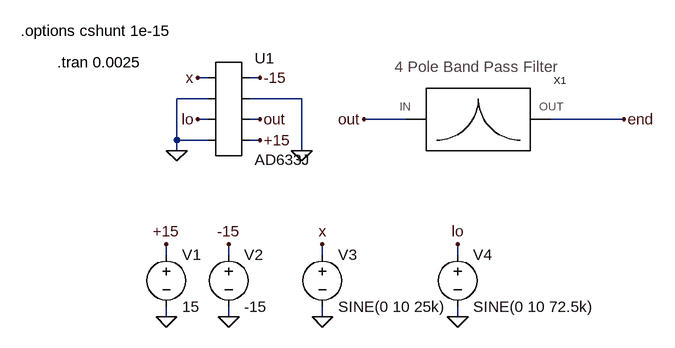
[diagram p0: schematic Draft1.asc]
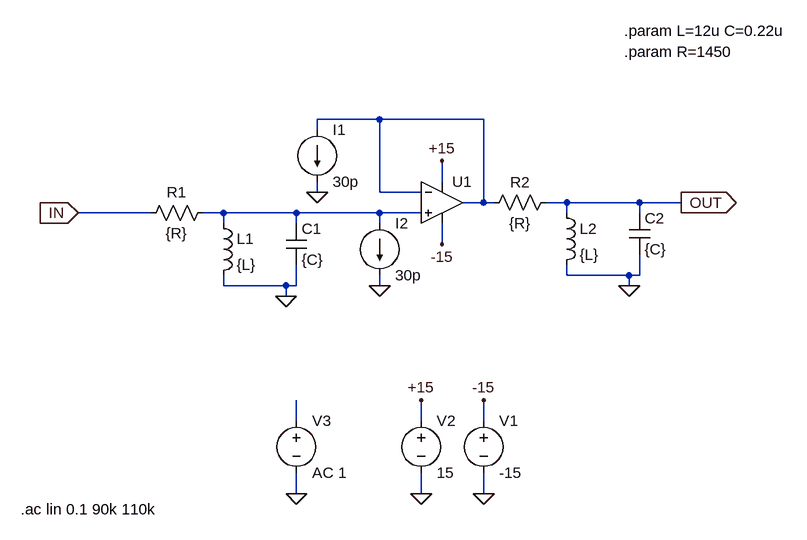
[diagram p1: sub-circuit 4p_bp_filter.asc]
Draft1.asc, the LTspice schematic file:
Version 4
SHEET 1 880 680
WIRE 128 112 112 112
WIRE 208 112 192 112
WIRE 128 144 80 144
WIRE 272 144 192 144
WIRE 128 176 112 176
WIRE 208 176 192 176
WIRE 432 176 368 176
WIRE 768 176 656 176
WIRE 80 208 80 144
WIRE 128 208 80 208
WIRE 208 208 192 208
WIRE 80 224 80 208
WIRE 272 224 272 144
WIRE 64 384 64 368
WIRE 160 384 160 368
WIRE 304 384 304 368
WIRE 512 384 512 368
WIRE 64 480 64 464
WIRE 160 480 160 464
WIRE 304 480 304 464
WIRE 512 480 512 464
FLAG 64 480 0
FLAG 160 480 0
FLAG 304 480 0
FLAG 512 480 0
FLAG 80 224 0
FLAG 64 368 +15
FLAG 160 368 -15
FLAG 304 368 x
FLAG 512 368 lo
FLAG 112 112 x
FLAG 112 176 lo
FLAG 208 208 +15
FLAG 208 112 -15
FLAG 272 224 0
FLAG 208 176 out
FLAG 368 176 out
FLAG 768 176 end
SYMBOL AutoGenerated\\AD633J 160 160 R0
SYMATTR InstName U1
SYMBOL voltage 64 368 R0
WINDOW 123 0 0 Left 0
WINDOW 39 0 0 Left 0
SYMATTR InstName V1
SYMATTR Value 15
SYMBOL voltage 160 368 R0
WINDOW 123 0 0 Left 0
WINDOW 39 0 0 Left 0
SYMATTR InstName V2
SYMATTR Value -15
SYMBOL voltage 304 368 R0
WINDOW 123 0 0 Left 0
WINDOW 39 0 0 Left 0
SYMATTR InstName V3
SYMATTR Value SINE(0 10 25k)
SYMBOL voltage 512 368 R0
WINDOW 123 0 0 Left 0
WINDOW 39 0 0 Left 0
SYMATTR InstName V4
SYMATTR Value SINE(0 10 72.5k)
SYMBOL 4P_BP_Filter 496 192 R0
SYMATTR InstName X1
TEXT -104 88 Left 2 !.tran 0.0025
TEXT -160 40 Left 2 !.options cshunt 1e-15

4p_bp_filter.asc, the sub-circuit schematic file:
Version 4
SHEET 1 880 680
WIRE 48 -80 -48 -80
WIRE 208 -80 48 -80
WIRE -48 -64 -48 -80
WIRE 144 16 144 -16
WIRE -48 32 -48 16
WIRE 48 32 48 -80
WIRE 112 32 48 32
WIRE 208 48 208 -80
WIRE 208 48 176 48
WIRE 224 48 208 48
WIRE 336 48 304 48
WIRE 448 48 336 48
WIRE 512 48 448 48
WIRE -304 64 -416 64
WIRE -192 64 -224 64
WIRE -80 64 -192 64
WIRE 48 64 -80 64
WIRE 112 64 48 64
WIRE 336 64 336 48
WIRE 448 64 448 48
WIRE -192 80 -192 64
WIRE -80 80 -80 64
WIRE 48 80 48 64
WIRE 144 112 144 80
WIRE 336 160 336 144
WIRE 432 160 336 160
WIRE 448 160 448 128
WIRE 448 160 432 160
WIRE -192 176 -192 160
WIRE -96 176 -192 176
WIRE -80 176 -80 144
WIRE -80 176 -96 176
WIRE 48 176 48 160
WIRE 432 176 432 160
WIRE -96 192 -96 176
WIRE -80 384 -80 352
WIRE 112 384 112 352
WIRE 208 384 208 352
WIRE -80 496 -80 464
WIRE 112 496 112 464
WIRE 208 496 208 464
FLAG 112 496 0
FLAG 208 496 0
FLAG 112 352 +15
FLAG 208 352 -15
FLAG 144 -16 +15
FLAG 144 112 -15
FLAG -96 192 0
FLAG 432 176 0
FLAG -48 32 0
FLAG 48 176 0
FLAG -416 64 IN
IOPIN -416 64 In
FLAG 512 48 OUT
IOPIN 512 48 Out
FLAG -80 496 0
SYMBOL OpAmps\\UniversalOpamp2 144 48 R0
SYMATTR InstName U1
SYMATTR Value2 Avol=1Meg GBW=5Meg Slew=12Meg Vos=3m
SYMBOL voltage 208 368 R0
WINDOW 123 0 0 Left 0
WINDOW 39 0 0 Left 0
SYMATTR InstName V1
SYMATTR Value -15
SYMBOL voltage 112 368 R0
WINDOW 123 0 0 Left 0
WINDOW 39 0 0 Left 0
SYMATTR InstName V2
SYMATTR Value 15
SYMBOL res -208 48 R90
WINDOW 0 0 56 VBottom 2
WINDOW 3 32 56 VTop 2
SYMATTR InstName R1
SYMATTR Value {R}
SYMATTR SpiceLine tol=1 pwr=.25
SYMBOL cap -96 80 R0
SYMATTR InstName C1
SYMATTR Value {C}
SYMATTR SpiceLine V=16
SYMBOL ind -208 64 R0
SYMATTR InstName L1
SYMATTR Value {L}
SYMBOL res 320 32 R90
WINDOW 0 0 56 VBottom 2
WINDOW 3 32 56 VTop 2
SYMATTR InstName R2
SYMATTR Value {R}
SYMATTR SpiceLine tol=1 pwr=.25
SYMBOL cap 432 64 R0
SYMATTR InstName C2
SYMATTR Value {C}
SYMATTR SpiceLine V=16
SYMBOL ind 320 48 R0
SYMATTR InstName L2
SYMATTR Value {L}
SYMBOL current -48 -64 R0
WINDOW 123 0 0 Left 0
WINDOW 39 0 0 Left 0
SYMATTR InstName I1
SYMATTR Value 30p
SYMBOL current 48 80 R0
WINDOW 123 0 0 Left 0
WINDOW 39 0 0 Left 0
SYMATTR InstName I2
SYMATTR Value 30p
SYMBOL voltage -80 368 R0
WINDOW 123 0 0 Left 0
WINDOW 39 0 0 Left 0
SYMATTR InstName V3
SYMATTR Value AC 1
TEXT 424 -184 Left 2 !.param R=1450
TEXT 424 -216 Left 2 !.param L=12u C=0.22u
TEXT -504 520 Left 2 !.ac lin 0.1 90k 110k

The netlist it stands for:
* Draft1.asc
* U1: AD633J (symbol AutoGenerated\AD633J not available, pins judged from their places): pin1=x pin2=0 pin3=lo pin4=0 pin5=-15 pin6=0 pin7=out pin8=+15
V1 +15 0 15
V2 -15 0 -15
V3 x 0 SINE(0 10 25k)
V4 lo 0 SINE(0 10 72.5k)
XX1 out end 4p_bp_filter

* block symbol definitions
.subckt 4p_bp_filter IN OUT
XU1 N002 N001 +15 -15 N001 level.2 Avol=1Meg GBW=5Meg Slew=12Meg Vos=3m ilimit=25m rail=0 Vos=0 phimargin=45 en=0 enk=0 in=0 ink=0 Rin=500Meg  ; pins IN+ IN- V+ V- OUT
V1 -15 0 -15
V2 +15 0 15
R1 N002 IN {R} tol=1 pwr=.25
C1 N002 0 {C} V=16
L1 N002 0 {L}
R2 OUT N001 {R} tol=1 pwr=.25
C2 OUT 0 {C} V=16
L2 OUT 0 {L}
I1 N001 0 30p
I2 N002 0 30p
V3 N003 0 AC 1
.param R=1450
.param L=12u C=0.22u
.ac lin 0.1 90k 110k
.ends 4p_bp_filter

.tran 0.0025
.options cshunt 1e-15
.lib UniversalOpamps2.sub
.backanno
.end

* Results of the author's LTspice run, read from the files saved beside the schematic
* Operating Point, zero values left out:
*   V(+15) = 15 V
*   V(-15) = -15 V
*   V(out) = 50.06 mV
*   I(V1) = -6.109 mA
*   I(V2) = 6.074 mA
*   I(V3) = -2.003 µA
*   I(V4) = -2.003 µA
*   Ix(u1:1) = 2.003 µA
*   Ix(u1:2) = 1.997 µA
*   Ix(u1:3) = 2.003 µA
*   Ix(u1:4) = 1.997 µA
*   Ix(u1:5) = -6.074 mA
*   Ix(u1:6) = 795 nA
*   Ix(u1:7) = -34.53 µA
*   Ix(u1:8) = 6.109 mA
*   Ix(x1:IN) = 34.53 µA